# Altium schematic sheet BL654.SchDoc
size A3; DocumentNumber: 2; SheetNumber: 2; SheetTotal: 7
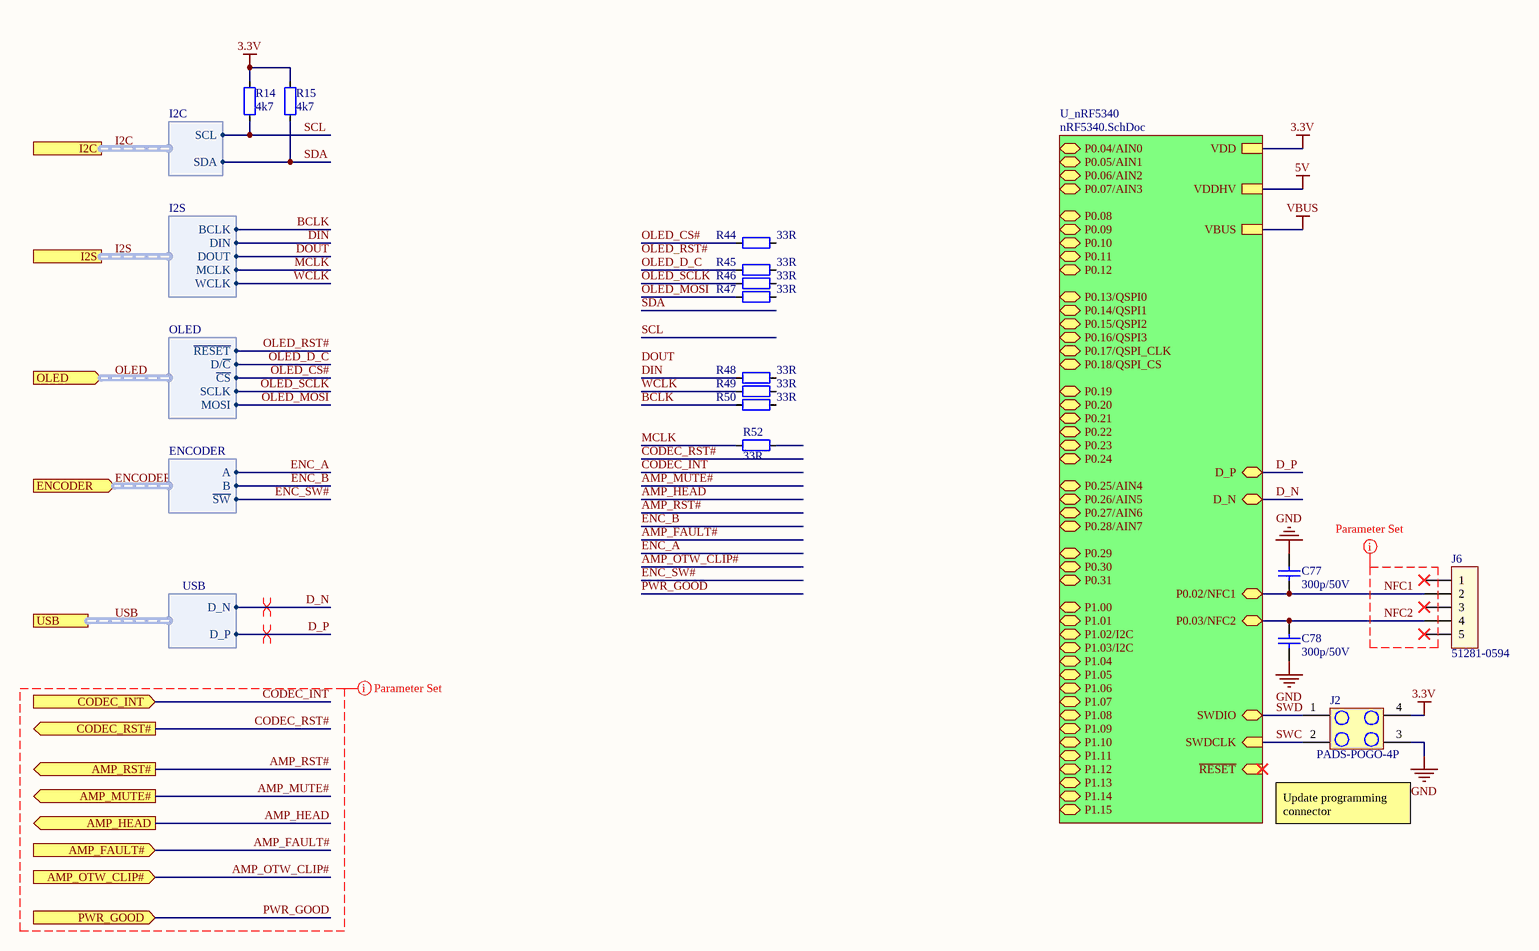
[diagram p0: BL654.SchDoc]

## Parts
C77  300p/50V  [C0402]
C78  300p/50V  [C0402]
J2  PADS-POGO-4P  [PADS-POGO-4P]  (no BOM)
J6  51281-0594  [51281-0594]
R14  4k7  [R0402]
R15  4k7  [R0402]
R44  33R  [R0402]
R45  33R  [R0402]
R46  33R  [R0402]
R47  33R  [R0402]
R48  33R  [R0402]
R49  33R  [R0402]
R50  33R  [R0402]
R52  33R  [R0402]

## Sub-sheets
U_nRF5340 = nRF5340.SchDoc: D_N (bidir), D_P (bidir), SWDIO (bidir), SWDCLK (in), P0.02/NFC1 (bidir), VDD, VDDHV, VBUS, ~{RESET} (in), P0.03/NFC2 (bidir), P0.04/AIN0 (bidir), P0.05/AIN1 (bidir), P0.06/AIN2 (bidir), P0.07/AIN3 (bidir), P0.08 (bidir), P0.09 (bidir), P0.10 (bidir), P0.11 (bidir), P0.12 (bidir), P0.13/QSPI0 (bidir), P0.14/QSPI1 (bidir), P0.15/QSPI2 (bidir), P0.16/QSPI3 (bidir), P0.17/QSPI_CLK (bidir), P0.18/QSPI_CS (bidir), P0.19 (bidir), P0.20 (bidir), P0.21 (bidir), P0.22 (bidir), P0.23 (bidir), P0.24 (bidir), P0.25/AIN4 (bidir), P0.26/AIN5 (bidir), P0.27/AIN6 (bidir), P0.28/AIN7 (bidir), P0.29 (bidir), P0.30 (bidir), P0.31 (bidir), P1.00 (bidir), P1.01 (bidir), P1.02/I2C (bidir), P1.03/I2C (bidir), P1.04 (bidir), P1.05 (bidir), P1.06 (bidir), P1.07 (bidir), P1.08 (bidir), P1.09 (bidir), P1.10 (bidir), P1.11 (bidir), P1.12 (bidir), P1.13 (bidir), P1.14 (bidir), P1.15 (bidir)

## Ports
AMP_FAULT# (in), AMP_HEAD (out), AMP_MUTE# (out), AMP_OTW_CLIP# (in), AMP_RST# (out), CODEC_INT (in), CODEC_RST# (out), ENCODER (in, harness ENCODER), I2C (harness I2C), I2S (harness I2S), OLED (in, harness OLED), PWR_GOOD (in), USB (harness USB)

## Harnesses
I2C: SCL, SDA
I2S: BCLK, DIN, DOUT, MCLK, WCLK
OLED: ~{CS}, D/~{C}, MOSI, ~{RESET}, SCLK
ENCODER: A, B, ~{SW}
USB: D_N, D_P

## Nets
3.3V: J2.4 R14.2 R15.2 ; sheet U_nRF5340/VDD
5V: sheet U_nRF5340/VDDHV
GND: C77.2 C78.1 J2.3
VBUS: sheet U_nRF5340/VBUS
AMP_FAULT#: port AMP_FAULT#
AMP_HEAD: port AMP_HEAD
AMP_MUTE#: port AMP_MUTE#
AMP_OTW_CLIP#: port AMP_OTW_CLIP#
AMP_RST#: port AMP_RST#
BCLK: R50.1 ; port I2S.BCLK
CODEC_INT: port CODEC_INT
CODEC_RST#: port CODEC_RST#
D_N: sheet U_nRF5340/D_N, port USB.D_N
D_P: sheet U_nRF5340/D_P, port USB.D_P
DIN: R48.1 ; port I2S.DIN
DOUT: port I2S.DOUT
ENC_A: port ENCODER.A
ENC_B: port ENCODER.B
ENC_SW#: port ENCODER.~{SW}
MCLK: R52.1 ; port I2S.MCLK  [project net I2S.MCLK]
NFC1: C77.1 J6.2 ; sheet U_nRF5340/P0.02/NFC1
NFC2: C78.2 J6.4 ; sheet U_nRF5340/P0.03/NFC2
OLED_CS#: R44.1 ; port OLED.~{CS}  [project net OLED.~{CS}]
OLED_D_C: R45.1 ; port OLED.D/~{C}  [project net OLED.D/~{C}]
OLED_MOSI: R47.1 ; port OLED.MOSI  [project net OLED.MOSI]
OLED_RST#: port OLED.~{RESET}  [project net OLED.~{RESET}]
OLED_SCLK: R46.1 ; port OLED.SCLK  [project net OLED.SCLK]
PWR_GOOD: port PWR_GOOD
SCL: R14.1 ; port I2C.SCL  [project net I2C.SCL]
SDA: R15.1 ; port I2C.SDA  [project net I2C.SDA]
SWC: J2.2 ; sheet U_nRF5340/SWDCLK
SWD: J2.1 ; sheet U_nRF5340/SWDIO
WCLK: R49.1 ; port I2S.WCLK  [project net I2S.WCLK]

Not connected (* = marked no-connect by the designer): J6 1* 3* 5*; R44 2; R45 2; R46 2; R47 2; R48 2; R49 2; R50 2; R52 2

## Buses and harness runs
harness ENCODER = port ENCODER
harness I2C = port I2C
harness I2S = port I2S
harness OLED = port OLED
harness USB = port USB

## Layout directives
differential pair: D_N, D_P
net class DIGITAL_SIGNALS: AMP_FAULT#, AMP_HEAD, AMP_MUTE#, AMP_OTW_CLIP#, AMP_RST#, CODEC_INT, CODEC_RST#, PWR_GOOD
net class NFC: NFC1, NFC2

## Notes on the sheet
- (near J2) Update programming connector
- Labels drawn without touching a wire or pin: DOUT, OLED_RST#
- Title
- Date:
- Number:
- Revision:
- Sheet
- of
- File:
- Author

## Library data of the parts
C77 C78 = 300p 50V X7R 0402: Manufacturer Part Number 1: CC0402KRX7R9BB301; Manufacturer 1: Yageo; Voltage: 50V; Tolerance: 10%; Specifications: X7R 300p 50V ±10%; Capacitance: 300p; Dielectric: X7R; Supplier 1: Mouser; Supplier Part Number 1: 603-CC0402KR9BB301
J2 = PADS-POGO-4P: Pads for 4 pin programming pogo to connect to
J6 = 51281-0594: FFC & FPC Connectors 0.5 FPC Non-ZIF 5Ckt Dual Contact; ComponentLink1Description: Datasheet; ComponentLink1URL: https://www.mouser.co.uk/datasheet/2/276/0512810594_FFC_FPC_CONNECTORS-170313.pdf; Manufacturer Part Number: 51281-0594; Supplier 1: Mouser; Supplier Part Number 1: 538-51281-0594
R14 R15 = 4k7 63mW 50V 0402: Manufacturer Part Number 1: AC0402FR-134K7L; Manufacturer 1: Yageo; Power Rating: 63mW; Tolerance: 1%; Voltage: 50V; Resistance: 4k7; Specifications: =Resistance+ ' '+"Power Rating "+Voltage+' ±'+Tolerance; Supplier 1: Mouser; Supplier Part Number 1: 603-AC0402FR-134K7L
R44-R50 R52 = 33R 63mW 50V 0402: Manufacturer Part Number 1: CRCW040233R0JNEDC; Manufacturer 1: Vishay; Power Rating: 63mW; Tolerance: 5%; Voltage: 50V; Resistance: 33R; Specifications: =Resistance+ ' '+"Power Rating "+Voltage+' ±'+Tolerance; Supplier 1: Mouser; Supplier Part Number 1: 71-CRCW040233R0JNEDC